# Altium schematic sheet BoardB-Python.SchDoc
size B; SheetNumber: 1; SheetTotal: 3
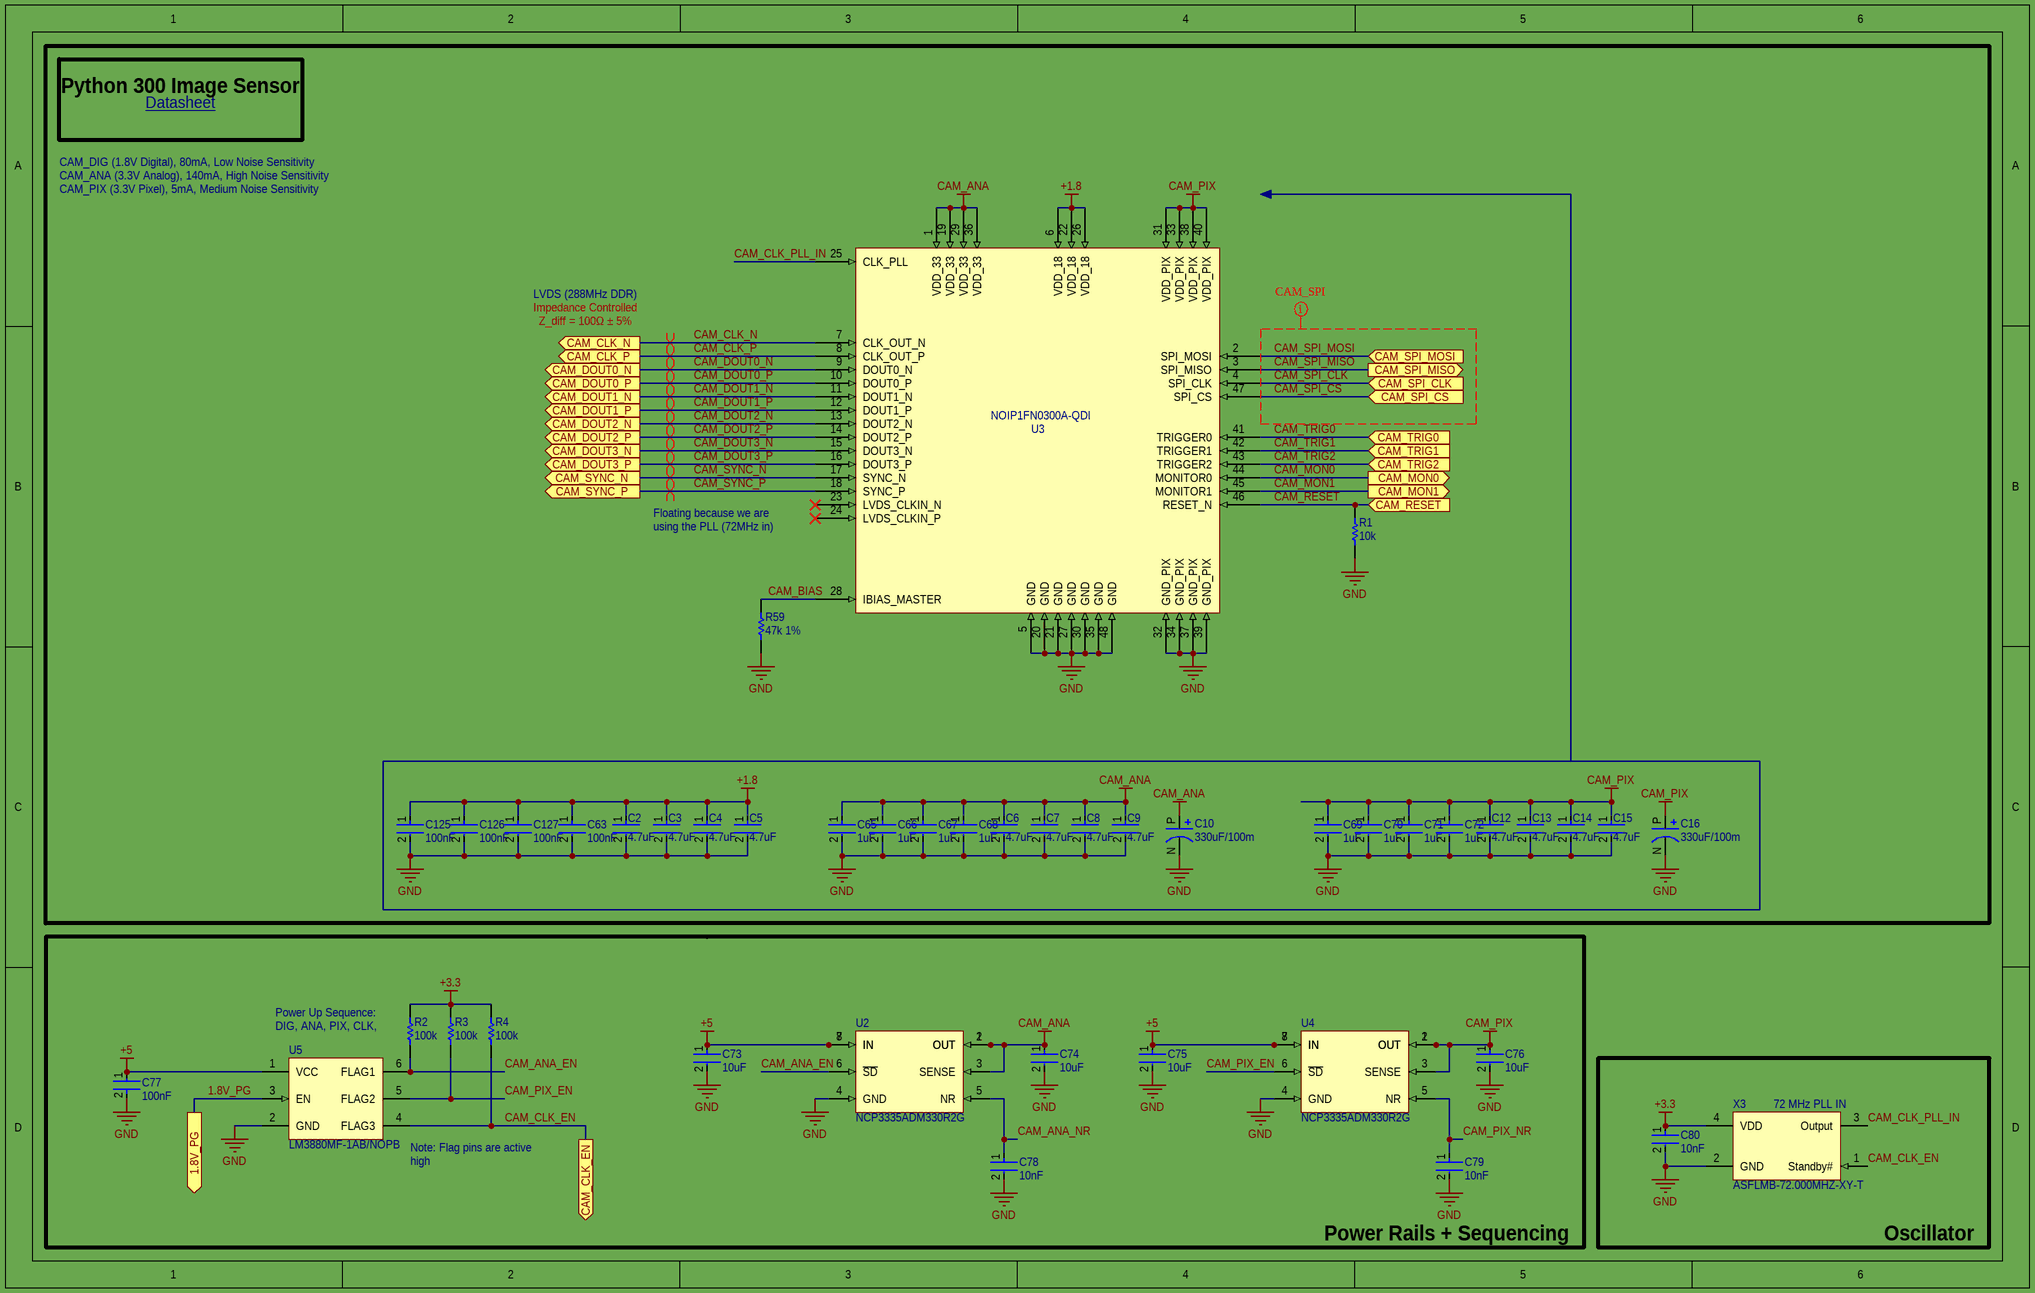
[diagram p0: BoardB-Python.SchDoc]

## Parts
C2  4.7uF  [FP-GRM155-0_1-IPC_B]
C3  4.7uF  [FP-GRM155-0_1-IPC_B]
C4  4.7uF  [FP-GRM155-0_1-IPC_B]
C5  4.7uF  [FP-GRM155-0_1-IPC_B]
C6  4.7uF  [FP-GRM155-0_1-IPC_B]
C7  4.7uF  [FP-GRM155-0_1-IPC_B]
C8  4.7uF  [FP-GRM155-0_1-IPC_B]
C9  4.7uF  [FP-GRM155-0_1-IPC_B]
C10  330uF/100m  [NOSD337M004R0100]
C12  4.7uF  [FP-GRM155-0_1-IPC_B]
C13  4.7uF  [FP-GRM155-0_1-IPC_B]
C14  4.7uF  [FP-GRM155-0_1-IPC_B]
C15  4.7uF  [FP-GRM155-0_1-IPC_B]
C16  330uF/100m  [NOSD337M004R0100]
C63  100nF  [FP-C0402-BB-MFG]
C65  1uF  [FP-GRM15-0_1-MFG]
C66  1uF  [FP-GRM15-0_1-MFG]
C67  1uF  [FP-GRM15-0_1-MFG]
C68  1uF  [FP-GRM15-0_1-MFG]
C69  1uF  [FP-GRM15-0_1-MFG]
C70  1uF  [FP-GRM15-0_1-MFG]
C71  1uF  [FP-GRM15-0_1-MFG]
C72  1uF  [FP-GRM15-0_1-MFG]
C73  10uF  [FP-CL05A106MP5NUNC-MFG]
C74  10uF  [FP-CL05A106MP5NUNC-MFG]
C75  10uF  [FP-CL05A106MP5NUNC-MFG]
C76  10uF  [FP-CL05A106MP5NUNC-MFG]
C77  100nF  [FP-GRM15-MFG]
C78  10nF  [FP-CC0402-MFG]
C79  10nF  [FP-CC0402-MFG]
C80  10nF  [FP-CC0402-MFG]
C125  100nF  [FP-C0402-BB-MFG]
C126  100nF  [FP-C0402-BB-MFG]
C127  100nF  [FP-C0402-BB-MFG]
R1  10k  [RESC1005X40X25LL05T05]
R2  100k  [RESC1005X40X25ML05T10]
R3  100k  [RESC1005X40X25ML05T10]
R4  100k  [RESC1005X40X25ML05T10]
R59  47k 1%  [RESC1005X40X25NL05T05]
U2  NCP3335ADM330R2G  [NCP3335ADM330R2G]
U3  NOIP1FN0300A-QDI  [NOIP1FN0300A-QDI]
U4  NCP3335ADM330R2G  [NCP3335ADM330R2G]
U5  LM3880MF-1AB/NOPB  [DBV0006A_M]
X3  ASFLMB-72.000MHZ-XY-T  [ASFLMB-72.000MHZ-XY-T]

## Blocks framed on the sheet
Python 300 Image Sensor: C2-C10 C12-C16 C63 C65-C72 C125-C127 R1 R59 U3
Power Rails + Sequencing: C73-C79 R2-R4 U2 U4 U5
Oscillator: C80 X3

## Ports
1.8V_PG (out), CAM_CLK_EN (out), CAM_CLK_N (out), CAM_CLK_P (out), CAM_DOUT0_N (out), CAM_DOUT0_P (out), CAM_DOUT1_N (out), CAM_DOUT1_P (out), CAM_DOUT2_N (out), CAM_DOUT2_P (out), CAM_DOUT3_N (out), CAM_DOUT3_P (out), CAM_MON0 (out), CAM_MON1 (out), CAM_RESET (in), CAM_SPI_CLK (in), CAM_SPI_CS (in), CAM_SPI_MISO (out), CAM_SPI_MOSI (in), CAM_SYNC_N (out), CAM_SYNC_P (out), CAM_TRIG0 (in), CAM_TRIG1 (in), CAM_TRIG2 (in)

## Nets
+1.8: C2.1 C3.1 C4.1 C5.1 C63.1 C125.1 C126.1 C127.1 U3.6(VDD_18) U3.22(VDD_18) U3.26(VDD_18)
+3.3: C80.1 R2.2 R3.2 R4.2 X3.4(VDD)
+5: C73.1 C75.1 C77.1 U2.7(IN) U2.8(IN) U4.7(IN) U4.8(IN) U5.1(VCC)
CAM_ANA: C6.1 C7.1 C8.1 C9.1 C10.P C65.1 C66.1 C67.1 C68.1 C74.1 U2.1(OUT) U2.2(OUT) U2.3(SENSE) U3.1(VDD_33) U3.19(VDD_33) U3.29(VDD_33) U3.36(VDD_33)
CAM_PIX: C12.1 C13.1 C14.1 C15.1 C16.P C69.1 C70.1 C71.1 C72.1 C76.1 U3.31(VDD_PIX) U3.33(VDD_PIX) U3.38(VDD_PIX) U3.40(VDD_PIX) U4.1(OUT) U4.2(OUT) U4.3(SENSE)
GND: C2.2 C3.2 C4.2 C5.2 C6.2 C7.2 C8.2 C9.2 C10.N C12.2 C13.2 C14.2 C15.2 C16.N C63.2 C65.2 C66.2 C67.2 C68.2 C69.2 C70.2 C71.2 C72.2 C73.2 C74.2 C75.2 C76.2 C77.2 C78.2 C79.2 C80.2 C125.2 C126.2 C127.2 R1.1 R59.1 U2.4(GND) U3.5(GND) U3.20(GND) U3.21(GND) U3.27(GND) U3.30(GND) U3.32(GND_PIX) U3.34(GND_PIX) U3.35(GND) U3.37(GND_PIX) U3.39(GND_PIX) U3.48(GND) U4.4(GND) U5.2(GND) X3.2(GND)
1.8V_PG: U5.3(EN) ; port 1.8V_PG
CAM_ANA_EN: R2.1 U2.6(~{SD}) U5.6(FLAG1)
CAM_ANA_NR: C78.1 U2.5(NR)
CAM_BIAS: R59.2 U3.28(IBIAS_MASTER)
CAM_CLK_EN: R4.1 U5.4(FLAG3) X3.1(Standby#) ; port CAM_CLK_EN
CAM_CLK_N: U3.7(CLK_OUT_N) ; port CAM_CLK_N
CAM_CLK_P: U3.8(CLK_OUT_P) ; port CAM_CLK_P
CAM_CLK_PLL_IN: U3.25(CLK_PLL) X3.3(Output)
CAM_DOUT0_N: U3.9(DOUT0_N) ; port CAM_DOUT0_N
CAM_DOUT0_P: U3.10(DOUT0_P) ; port CAM_DOUT0_P
CAM_DOUT1_N: U3.11(DOUT1_N) ; port CAM_DOUT1_N
CAM_DOUT1_P: U3.12(DOUT1_P) ; port CAM_DOUT1_P
CAM_DOUT2_N: U3.13(DOUT2_N) ; port CAM_DOUT2_N
CAM_DOUT2_P: U3.14(DOUT2_P) ; port CAM_DOUT2_P
CAM_DOUT3_N: U3.15(DOUT3_N) ; port CAM_DOUT3_N
CAM_DOUT3_P: U3.16(DOUT3_P) ; port CAM_DOUT3_P
CAM_MON0: U3.44(MONITOR0) ; port CAM_MON0
CAM_MON1: U3.45(MONITOR1) ; port CAM_MON1
CAM_PIX_EN: R3.1 U4.6(~{SD}) U5.5(FLAG2)
CAM_PIX_NR: C79.1 U4.5(NR)
CAM_RESET: R1.2 U3.46(RESET_N) ; port CAM_RESET
CAM_SPI_CLK: U3.4(SPI_CLK) ; port CAM_SPI_CLK
CAM_SPI_CS: U3.47(SPI_CS) ; port CAM_SPI_CS
CAM_SPI_MISO: U3.3(SPI_MISO) ; port CAM_SPI_MISO
CAM_SPI_MOSI: U3.2(SPI_MOSI) ; port CAM_SPI_MOSI
CAM_SYNC_N: U3.17(SYNC_N) ; port CAM_SYNC_N
CAM_SYNC_P: U3.18(SYNC_P) ; port CAM_SYNC_P
CAM_TRIG0: U3.41(TRIGGER0) ; port CAM_TRIG0
CAM_TRIG1: U3.42(TRIGGER1) ; port CAM_TRIG1
CAM_TRIG2: U3.43(TRIGGER2) ; port CAM_TRIG2

Not connected (* = marked no-connect by the designer): U3 23(LVDS_CLKIN_N)* 24(LVDS_CLKIN_P)*

## Layout directives
differential pair; differential pair class CAM_CLK_OUT; rule Signal Stimulus [Kind - Single Pulse    Level - High    Start Time = 0.000    Stop Time = 1.389n    Period Time = 2.778n]: CAM_CLK_N, CAM_CLK_P
differential pair; differential pair class CAM_DOUT0; rule Signal Stimulus [Kind - Single Pulse    Level - High    Start Time = 0.000    Stop Time = 1.389n    Period Time = 2.778n]: CAM_DOUT0_N, CAM_DOUT0_P
differential pair; differential pair class CAM_DOUT1; rule Signal Stimulus [Kind - Single Pulse    Level - High    Start Time = 0.000    Stop Time = 1.389n    Period Time = 2.778n]: CAM_DOUT1_N, CAM_DOUT1_P
differential pair; differential pair class CAM_DOUT2; rule Signal Stimulus [Kind - Single Pulse    Level - High    Start Time = 0.000    Stop Time = 1.389n    Period Time = 2.778n]: CAM_DOUT2_N, CAM_DOUT2_P
differential pair; differential pair class CAM_DOUT3; rule Signal Stimulus [Kind - Single Pulse    Level - High    Start Time = 0.000    Stop Time = 1.389n    Period Time = 2.778n]: CAM_DOUT3_N, CAM_DOUT3_P
differential pair; differential pair class CAM_SYNC; rule Signal Stimulus [Kind - Single Pulse    Level - High    Start Time = 0.000    Stop Time = 1.389n    Period Time = 2.778n]: CAM_SYNC_N, CAM_SYNC_P
mark named CAM_SPI: CAM_SPI_CLK, CAM_SPI_CS, CAM_SPI_MISO, CAM_SPI_MOSI

## Notes on the sheet
- Datasheet <https://www.onsemi.com/pdf/datasheet/noip1sn1300a-d.pdf>
- CAM_DIG (1.8V Digital), 80mA, Low Noise Sensitivity
  CAM_ANA (3.3V Analog), 140mA, High Noise Sensitivity
  CAM_PIX (3.3V Pixel), 5mA, Medium Noise Sensitivity
- LVDS (288MHz DDR)
- Impedance Controlled
- Z_diff = 100Ω ± 5%
- Floating because we are using the PLL (72MHz in)
- (near R2) Power Up Sequence:
  DIG, ANA, PIX, CLK, RESET
- (near X3) 72 MHz PLL IN
- (near U5) Note: Flag pins are active high

## Library data of the parts
C2-C9 C12-C15 = CMP-2008-04549-2: Chip Multilayer Ceramic Capacitors for General Purpose, 0402, 4.7uF, X5R, 15%, 20%, 6.3V; Height: 0.5mm; Weight: 0.000212oz; Length: 1mm; Case Code (Metric): 1005; Packaging: Tape and Reel; Termination: SMD/SMT; Dielectric: X5R; Depth: 0.5mm; Case Code (Imperial): 0402; Min Operating Temperature: -55°C; Case/Package: 0402; Voltage: 6.3V; Width: 0.02inch; Capacitance: 4.7uF; Lead Free: Lead Free; Thickness: 0.022inch; Contact Plating: Tin; REACH SVHC: No SVHC; Package Quantity: 10000; Tolerance: 20%; Voltage Rating (DC): 6.3V; Voltage Rating: 6.3V; Mount: Surface Mount; Max Operating Temperature: 85°C
C10 C16 = NOSD337M004R0100: 330uF +/-20% 4 V dc SMD Niobium Capacitor; 7343-31 package; ESR 0.1Ohms NOS; Manufacturer: Kyocera AVX; Dielectric Material: Tantalum; Voltage Rating: 4V; Tolerance: 20%; ESR (Equivalent Series Resistance): 100mR; Ripple Current: 1.342A; Dissipation Factor: 8%; Leakage Current: 26.4uA; Supplier 1: Arrow Electronics; Manufacturer Part Number: NOSD337M004R0100; RoHS: Yes; Category: Capacitors; Stock 1: 523; Pricing 1: 1=0.86820, 10=0.76450, 25=0.75680, 100=0.63080, 250=0.62450, 500=0.53480 (USD); Mount: Surface Mount; Case/Package: 2917; Case Code (Metric): 7343; Case Code (Imperial): 2917; Min Operating Temperature: -55°C; Max Operating Temperature: 125°C; Package Quantity: 500; Capacitance: 330uF; Packaging: Tape and Reel; Termination: SMD/SMT; Voltage: 4V; Series: NOS; Construction: Flat; Length: 7.3mm; Width: 4.3mm; Height: 2.9mm; Height - Seated (Max): 0.122inch; Depth: 4.3mm; Radiation Hardening: No; REACH SVHC: No SVHC; Lead Free: Lead Free; RoHS Compliant: Yes; ComponentLink1URL: https://datasheet.ciiva.com/257/nos-257040.pdf?src-supplier=Digi-Key; ComponentLink1Description: https://datasheet.ciiva.com/257/nos-257040.pdf?src-supplier=Digi-Key; ComponentLink2URL: https://datasheet.ciiva.com/11790/0900766b8070be5a-11790395.pdf?src-supplier=RSComponents; ComponentLink2Description: https://datasheet.ciiva.com/11790/0900766b8070be5a-11790395.pdf?src-supplier=RSComponents; ComponentLink3URL: https://datasheet.ciiva.com/257/nos-257041.pdf?src-supplier=Digi-Key; ComponentLink3Description: https://datasheet.ciiva.com/257/nos-257041.pdf?src-supplier=Digi-Key; ComponentLink4URL: https://datasheet.ciiva.com/257/nos-257042.pdf?src-supplier=Digi-Key; ComponentLink4Description: https://datasheet.ciiva.com/257/nos-257042.pdf?src-supplier=Digi-Key; ComponentLink5URL: https://datasheet.ciiva.com/2998/nos-2998262.pdf?src-supplier=Avnet; ComponentLink5Description: https://datasheet.ciiva.com/2998/nos-2998262.pdf?src-supplier=Avnet; ComponentLink6URL: https://datasheet.ciiva.com/29882/nos-29882333.pdf?src-supplier=Avnet; ComponentLink6Description: https://datasheet.ciiva.com/29882/nos-29882333.pdf?src-supplier=Avnet; ComponentLink7URL: https://datasheet.ciiva.com/1460/49917-1460418.pdf?src-supplier=Element14; ComponentLink7Description: https://datasheet.ciiva.com/1460/49917-1460418.pdf?src-supplier=Element14; ComponentLink8URL: https://datasheet.ciiva.com/1460/49917-1460419.pdf?src-supplier=Element14; ComponentLink8Description: https://datasheet.ciiva.com/1460/49917-1460419.pdf?src-supplier=Element14; Supplier Part Number 1: NOSD337M004R0100
C63 C125-C127 = CMP-2008-02046-2: CAP CER 0.1UF 10V X5R 0402; Manufacturer: Kemet; Manufacturer Part Number: C0402C104K8PACTU; Material: Ceramic; Capacitance: 0.10 μF; Temperature Coefficient: 15%; Tolerance: 0.1; Value: 0.10 μF; Package: C0402-BB; Temperature: -55°C to +125°C; ComponentLink2Description: Datasheet; Temperature Characteristic: X5R; Device Class L1: Passive Components; Height: 0.55mm; Lead Free: Yes; ComponentLink2URL: https://content.kemet.com/datasheets/KEM_C1002_X7R_SMD.pdf; Device Class L2: Capacitors; Temperature Range Low: -55°C; Temperature Range High: +125°C; RoHS: TRUE; Octopart: https://octopart.com/c0402c104k8pactu-kemet-140039; Automotive: No; Mouser Description: Capacitor 100 nF 10 VDC 0402; Category: Cap; Voltage Rating: 10 V; Digikey Description: CAP CER 0.1UF 10V X5R 0402; Ipc Land Pattern Name: CAPC10050X50; Device Class L3: Ceramic Capacitors
C65-C72 = CMP-2008-04556-2: CAP CER 1UF 10V X5R 0402; Manufacturer Part Number: GRM155R61A105KE15D; Manufacturer: Murata; Material: Ceramic; Tolerance: 10%; Temperature Coefficient: 15%; Octopart: https://octopart.com/grm155r61a105ke15d-murata-197442; Lead Free: Yes; ComponentLink2Description: Datasheet; Temperature: -55°C to +85°C; Temperature Range High: +85°C; Height: 0.55mm; Capacitance: 1uF; Ipc Land Pattern Name: CAPC10050X50; ComponentLink2URL: https://search.murata.co.jp/Ceramy/image/img/A01X/G101/ENG/GRM155R61A105KE15-01A.pdf; Temperature Range Low: -55°C; Device Class L2: Capacitors; Voltage Rating: 10V; RoHS: TRUE; Device Class L1: Passive Components; Device Class L3: Ceramic Capacitors; Temperature Characteristic: X5R; Mouser Description: 0402 1 uF 10 V ±10% Tolerance X5R Surface Mount Multilayer Ceramic Capacitor; Automotive: No; Package: GRM15-0.1; Digikey Description: CAP CER 1UF 10V X5R 0402; Value: 1uF; Category: Cap
C73-C76 = CMP-13271-000002-1: CAP CER 10UF 10V X5R 0402; Manufacturer Part Number: CL05A106MP5NUNC; Manufacturer: Samsung; Temperature Coefficient: 15%; Tolerance: 20%; Material: Ceramic; Octopart: https://octopart.com/cl05a106mp5nunc-samsung-22457395; Voltage Rating: 10V; RoHS: TRUE; Value: 10uF; Height: 0.7mm; Digikey Description: CAP CER 10UF 10V X5R 0402; Automotive: No; Package: CL05A106MP5NUNC; Device Class L1: Passive Components; Capacitance: 10uF; Temperature Range High: +85°C; ComponentLink2Description: Datasheet; Device Class L2: Capacitors; Temperature Characteristic: X5R; Temperature: -55°C to +85°C; ComponentLink2URL: http://www.samsungsem.com/kr/support/product-search/mlcc/__icsFiles/afieldfile/2019/05/10/19-CL05A106MP5NUNC.pdf; Device Class L3: Ceramic Capacitors; Category: Cap; Temperature Range Low: -55°C; Ipc Land Pattern Name: CAPC10050X50; Lead Free: Yes
C77 = CMP-2100-03641-2: CAP CER 0.1UF 16V X7R 0402; Manufacturer Part Number: GRM155R71C104KA88D; Manufacturer: Murata; Standoff Height: 0mm; Tolerance: 10%; Voltage Rating: 16Vdc; Material: Ceramic; Capacitance: 0.10μF; Value: 0.10μF; RoHS: TRUE; Temperature Characteristic: X7R; Octopart: https://octopart.com/grm155r71c104ka88d-murata-196880; Digikey Description: CAP CER 0.1UF 16V X7R 0402; Device Class L3: Ceramic Capacitors; Height: 0.55mm; ComponentLink2Description: Datasheet; Temperature Range Low: -55°C; Ipc Land Pattern Name: CAPC10050X219; ComponentLink2URL: https://search.murata.co.jp/Ceramy/image/img/A01X/G101/ENG/GRM155R71H471KA01-01A.pdf; Device Class L1: Passive Components; Lead Free: yes; Category: Cap; Package: GRM15; Temperature: -55°C to +125°C; Device Class L2: Capacitors; Temperature Range High: +125°C; Mouser Description: 0402 0.1 uF 16V ±10 % Tolerance X7R SMT Multilayer Ceramic Capacitor
C78-C80 = CMP-03422-000501-1: CAP CER 10000PF 16V X7R 0402; Manufacturer Part Number: CC0402KRX7R7BB103; Manufacturer: YAGEO; Automotive Grade: NA; Material: Ceramic; Tolerance: 0.1; Temperature Coefficient: 30ppm/°C; Temperature Range Low: -55°C; Temperature Range High: +125°C; Mouser Description: 0402 10 nF 16 V ±10 % Tolerance X7R SMT Multilayer Ceramic Capacitor; Footprint Url: http://www.yageo.com/exep/pages/download/literatures/UPY-C_GEN_24.pdf; Category: Cap; RoHS: TRUE; Capacitance: 10 nF; ComponentLink2Description: Datasheet; Ipc Land Pattern Name: CAPC10050X50; Value: 10 nF; Automotive: No; ComponentLink2URL: http://www.yageo.com/documents/recent/UPY-GP_NP0_16V-to-50V_16.pdf; Device Class L1: Passive Components; Height: 0.55mm; Temperature Characteristic: X7R; Package: CC0402; Voltage Rating: 16 V; Device Class L3: Ceramic Capacitors; Lead Free: Yes; Device Class L2: Capacitors; Digikey Description: CAP CER 10000PF 16V X7R 0402; Octopart: https://octopart.com/cc0402krx7r7bb103-yageo-192895; Temperature: -55°C to +125°C
R1 = CMP-2000-07588-1: Chip Resistor, 10 KOhm, +/- 1%, 0.1 W, -55 to 155 degC, 0402 (1005 Metric), RoHS, Tape and Reel; Manufacturer: Panasonic; Power Rating: 100mW; Voltage Rating: 50V; Resistance: 10KOhm; Case\/Package: 0402; Temperature Coefficient: 100ppm\/degreesC; RoHSCompliant: True; Lead Free: LeadFree; Package Quantity: 1; Contact Plating: Tin; Length: 1mm; Radiation Hardening: No; REACH SVHC: NoSVHC; Max Operating Temperature: 155degC; Depth: 0.5mm; Case Code (Imperial): 0402; Military Standard: Not; Package Description: 2-Pin Surface Mount Device, Body 1 x 0.5 mm; Termination: SMD/SMT; Case Code (Metric): 1005; Height: 0.35mm; Packaging: TapeandReel; Voltage Rating (DC): 50V; Package Reference: 402; Number of Pins: 2; Tolerance: 1%; Mounting Technology: SurfaceMount; Width: 0.02inch; Mount: SurfaceMount; Datasheet URL: https://industrial.panasonic.com/cdbs/www-data/pdf/RDA0000/AOA0000C304.pdf; Composition: ThickFilm; Datasheet Version: 02/2017; Manufacturer URL: http://www.panasonic.com/; Max Power Dissipation: 100mW; Number of Terminations: 2; Min Operating Temperature: -55degC
R2-R4 = CMP-2002-07343-1: Part Number: RC0402FR-07100KL; Manufacturer: Yageo / Phycomp
R59 = CMP-2002-01155-1: Part Number: ERJ2RKF4702X; Manufacturer: Panasonic
U2 U4 = NCP3335ADM330R2G: Linear Voltage Regulator, LDO, Ultra High Accuracy, Low Iq, 500 mA, V out : 3.3 V; Manufacturer: ON Semiconductor; Min Input Voltage: 2.6V; Max Input Voltage: 16V; Output Voltage: 3.3V; Number of Outputs: 1; Max Output Current: 800mA; Polarity: Positive; Accuracy: 0.9%; Output Type: Fixed; Dropout Voltage: 340mV; Reference Voltage: 1.269V; Supplier 1: Arrow Electronics; Manufacturer Part Number: NCP3335ADM330R2G; RoHS: Yes; Category: Voltage Regulators - Linear; Stock 1: 3509; Pricing 1: 1=1.27050, 10=1.10060, 25=0.93500, 100=0.82150, 250=0.81330, 500=0.66300, 1000=0.61180, 3000=0.57730 (USD); Mount: Surface Mount; Case/Package: MSOP; Number of Pins: 8; Min Operating Temperature: -40°C; Max Operating Temperature: 150°C; Package Quantity: 4000; Output Current: 800mA; Packaging: Tape and Reel; Number of Regulators: 1; Min Output Voltage: 3.3V; Output Voltage Accuracy: 0.9%; Length: 3.1mm; Width: 3.1mm; Height: 0.95mm; Radiation Hardening: No; Lead Free: Lead Free; Halogen Free: Halogen Free; RoHS Compliant: Yes; ComponentLink1URL: https://datasheet.ciiva.com/30476/0900766b8124f876-30476966.pdf?src-supplier=RSComponents; ComponentLink1Description: https://datasheet.ciiva.com/30476/0900766b8124f876-30476966.pdf?src-supplier=RSComponents; ComponentLink2URL: https://datasheet.ciiva.com/2061/ncp3335a-d-2061837.pdf?src-supplier=Digi-Key; ComponentLink2Description: https://datasheet.ciiva.com/2061/ncp3335a-d-2061837.pdf?src-supplier=Digi-Key; ComponentLink3URL: https://datasheet.ciiva.com/2061/ncp3335a-d-2061838.pdf?src-supplier=Digi-Key; ComponentLink3Description: https://datasheet.ciiva.com/2061/ncp3335a-d-2061838.pdf?src-supplier=Digi-Key; ComponentLink4URL: https://datasheet.ciiva.com/16390/ncp3335a-d-16390281.pdf?src-supplier=Future+Electronics; ComponentLink4Description: https://datasheet.ciiva.com/16390/ncp3335a-d-16390281.pdf?src-supplier=Future+Electronics; Supplier Part Number 1: NCP3335ADM330R2G
U3 = NOIP1FN0300A-QDI: IC IMAGE SENSOR 0.3MP 48LCC; Manufacturer: ON Semiconductor; Operating Supply Voltage: 3.4V; Supplier 1: Avnet; Manufacturer Part Number: NOIP1FN0300A-QDI; RoHS: Yes; Category: Optoelectronics; Pricing 1: 6=58.23675, 8=57.37875, 20=56.62800, 30=55.87725, 60=55.12650, 300=53.83950, 600=53.41050 (USD); Mount: Surface Mount; Case/Package: LCC; Number of Pins: 48; Min Operating Temperature: -40°C; Max Operating Temperature: 85°C; Lead Free: Lead Free; RoHS Compliant: Yes; ComponentLink1URL: http://www.onsemi.com/pub_link/Collateral/PB_NOIP1SN1300A-D.PDF?src-supplier=Digi-Key; ComponentLink1Description: http://www.onsemi.com/pub_link/Collateral/PB_NOIP1SN1300A-D.PDF?src-supplier=Digi-Key; ComponentLink2URL: http://www.onsemi.com/pub_link/Collateral/NOIP1SN1300A-D.PDF?src-supplier=Avnet+Asia; ComponentLink2Description: http://www.onsemi.com/pub_link/Collateral/NOIP1SN1300A-D.PDF?src-supplier=Avnet+Asia; Supplier Part Number 1: NOIP1FN0300A-QDI
U5 = CMP-0063-01011-4: Power Sequencer, 6-pin SOT-23, Pb-Free, 1000 Reel; Manufacturer: Texas Instruments; High-Reliability: Y; CompType: MiscPower; PowerWise: N; PackageTopMarking: F21A*XTT; Code_JEDEC: MO-178-AB; PartNumber: LM3880MF-1AB/NOPB; RoHS: Y; PackageReference: DBV0006A; ComponentLink1Description: Datasheet URL; Code_IPC: SOT26A-6; PinCount: 6; PackageDescription: Molded SOT-23, .115 x .063 x .040in Body, 6 Lead, .0375in in Pitch; ComponentLink1URL: http://www.ti.com/general/docs/lit/getliterature.tsp?genericPartNumber=LM3880&fileType=pdf
X3 = ASFLMB-72.000MHZ-XY-T: Silicon Oscillator 72MHz 15pF ±10ppm 4-Pin QFN T/R; Manufacturer: Abracon; Operating Supply Voltage: 3.6V; Max Supply Current: 16mA; Supplier 1: Mouser; Manufacturer Part Number: ASFLMB-72.000MHZ-XY-T; RoHS: Yes; Category: Oscillators; Stock 1: 318; Pricing 1: 1=3.61000, 10=3.45000, 50=3.27000, 100=2.93000, 500=2.76000, 1000=2.40000, 10000=2.40000 (USD); Mount: Surface Mount; Case/Package: SMD/SMT; Number of Pins: 4; Min Operating Temperature: -40°C; Max Operating Temperature: 105°C; Frequency: 72MHz; Load Capacitance: 15pF; Packaging: Tape and Reel; Frequency Stability: 10ppm; Termination: SMD/SMT; Series: Pure Silicon™ ASFLMB; Length: 0.197inch; Width: 0.126inch; Height: 0.035inch; Radiation Hardening: No; ComponentLink1URL: https://datasheet.ciiva.com/870/memspeedproflyerii-870042.pdf?src-supplier=Digi-Key; ComponentLink1Description: https://datasheet.ciiva.com/870/memspeedproflyerii-870042.pdf?src-supplier=Digi-Key; ComponentLink2URL: https://datasheet.ciiva.com/870/memspeedproflyerii-870043.pdf?src-supplier=Digi-Key; ComponentLink2Description: https://datasheet.ciiva.com/870/memspeedproflyerii-870043.pdf?src-supplier=Digi-Key; ComponentLink3URL: https://datasheet.ciiva.com/870/memspeedproflyerii-870044.pdf?src-supplier=Digi-Key; ComponentLink3Description: https://datasheet.ciiva.com/870/memspeedproflyerii-870044.pdf?src-supplier=Digi-Key; ComponentLink4URL: https://datasheet.ciiva.com/3178/asflmb-3178058.pdf?src-supplier=Avnet; ComponentLink4Description: https://datasheet.ciiva.com/3178/asflmb-3178058.pdf?src-supplier=Avnet; ComponentLink5URL: https://datasheet.ciiva.com/13163/asflmb-24525-13163049.pdf?src-supplier=Mouser; ComponentLink5Description: https://datasheet.ciiva.com/13163/asflmb-24525-13163049.pdf?src-supplier=Mouser; Supplier Part Number 1: 815-ASFLMB-72-XY-T